# Altium schematic sheet FPC_15ICS_80LEDS_150MM.SchDoc
size A2
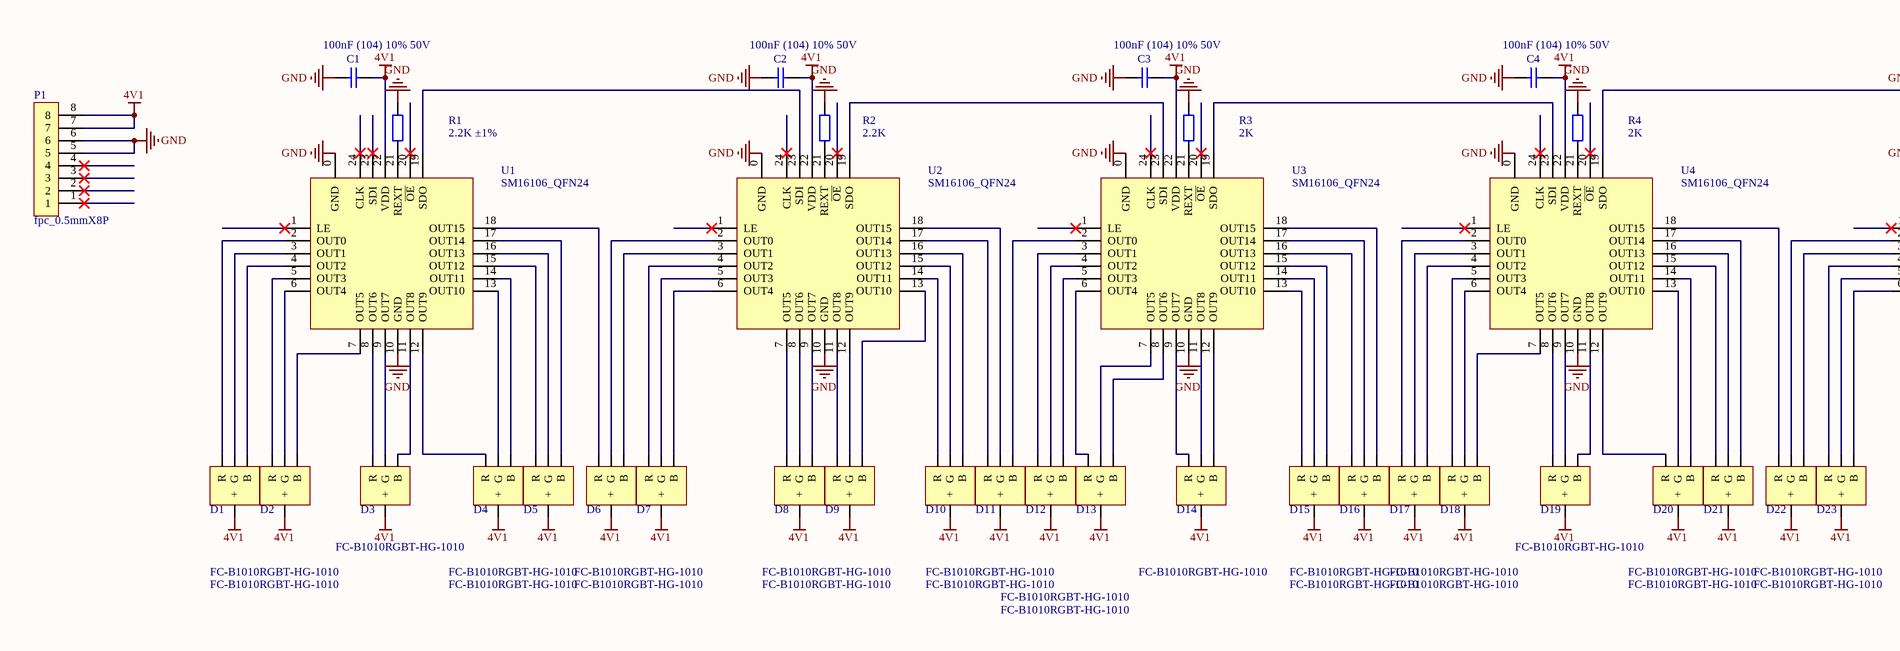
[diagram p0: FPC_15ICS_80LEDS_150MM.SchDoc, left]
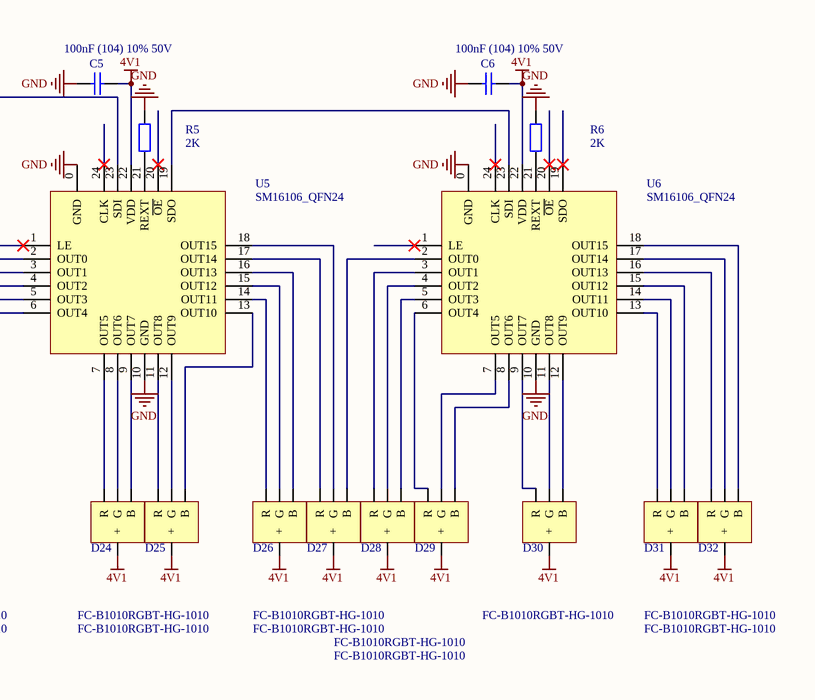
[diagram p1: FPC_15ICS_80LEDS_150MM.SchDoc, right]

## Parts
C1  100nF (104) 10% 50V  [0402_C]
C2  100nF (104) 10% 50V  [0402_C]
C3  100nF (104) 10% 50V  [0402_C]
C4  100nF (104) 10% 50V  [0402_C]
C5  100nF (104) 10% 50V  [0402_C]
C6  100nF (104) 10% 50V  [0402_C]
D1  FC-B1010RGBT-HG-1010  [LED-SMD-0.385X0.45X0.45]
D2  FC-B1010RGBT-HG-1010  [LED-SMD-0.385X0.45X0.45]
D3  FC-B1010RGBT-HG-1010  [LED-SMD-0.385X0.45X0.45]
D4  FC-B1010RGBT-HG-1010  [LED-SMD-0.385X0.45X0.45]
D5  FC-B1010RGBT-HG-1010  [LED-SMD-0.385X0.45X0.45]
D6  FC-B1010RGBT-HG-1010  [LED-SMD-0.385X0.45X0.45]
D7  FC-B1010RGBT-HG-1010  [LED-SMD-0.385X0.45X0.45]
D8  FC-B1010RGBT-HG-1010  [LED-SMD-0.385X0.45X0.45]
D9  FC-B1010RGBT-HG-1010  [LED-SMD-0.385X0.45X0.45]
D10  FC-B1010RGBT-HG-1010  [LED-SMD-0.385X0.45X0.45]
D11  FC-B1010RGBT-HG-1010  [LED-SMD-0.385X0.45X0.45]
D12  FC-B1010RGBT-HG-1010  [LED-SMD-0.385X0.45X0.45]
D13  FC-B1010RGBT-HG-1010  [LED-SMD-0.385X0.45X0.45]
D14  FC-B1010RGBT-HG-1010  [LED-SMD-0.385X0.45X0.45]
D15  FC-B1010RGBT-HG-1010  [LED-SMD-0.385X0.45X0.45]
D16  FC-B1010RGBT-HG-1010  [LED-SMD-0.385X0.45X0.45]
D17  FC-B1010RGBT-HG-1010  [LED-SMD-0.385X0.45X0.45]
D18  FC-B1010RGBT-HG-1010  [LED-SMD-0.385X0.45X0.45]
D19  FC-B1010RGBT-HG-1010  [LED-SMD-0.385X0.45X0.45]
D20  FC-B1010RGBT-HG-1010  [LED-SMD-0.385X0.45X0.45]
D21  FC-B1010RGBT-HG-1010  [LED-SMD-0.385X0.45X0.45]
D22  FC-B1010RGBT-HG-1010  [LED-SMD-0.385X0.45X0.45]
D23  FC-B1010RGBT-HG-1010  [LED-SMD-0.385X0.45X0.45]
D24  FC-B1010RGBT-HG-1010  [LED-SMD-0.385X0.45X0.45]
D25  FC-B1010RGBT-HG-1010  [LED-SMD-0.385X0.45X0.45]
D26  FC-B1010RGBT-HG-1010  [LED-SMD-0.385X0.45X0.45]
D27  FC-B1010RGBT-HG-1010  [LED-SMD-0.385X0.45X0.45]
D28  FC-B1010RGBT-HG-1010  [LED-SMD-0.385X0.45X0.45]
D29  FC-B1010RGBT-HG-1010  [LED-SMD-0.385X0.45X0.45]
D30  FC-B1010RGBT-HG-1010  [LED-SMD-0.385X0.45X0.45]
D31  FC-B1010RGBT-HG-1010  [LED-SMD-0.385X0.45X0.45]
D32  FC-B1010RGBT-HG-1010  [LED-SMD-0.385X0.45X0.45]
P1  fpc_0.5mmX8P  [goldfiger_fpc_8]
R1  2.2K ±1%  [0603_R]
R2  2.2K  [0603_R]
R3  2K  [0603_R]
R4  2K  [0603_R]
R5  2K  [0603_R]
R6  2K  [0603_R]
U1  SM16106_QFN24  [QFN-24_4x4x05tcp]
U2  SM16106_QFN24  [QFN-24_4x4x05tcp]
U3  SM16106_QFN24  [QFN-24_4x4x05tcp]
U4  SM16106_QFN24  [QFN-24_4x4x05tcp]
U5  SM16106_QFN24  [QFN-24_4x4x05tcp]
U6  SM16106_QFN24  [QFN-24_4x4x05tcp]

## Nets
4V1: C1.2 C2.2 C3.2 C4.2 C5.2 C6.2 D1.1(+) D2.1(+) D3.1(+) D4.1(+) D5.1(+) D6.1(+) D7.1(+) D8.1(+) D9.1(+) D10.1(+) D11.1(+) D12.1(+) D13.1(+) D14.1(+) D15.1(+) D16.1(+) D17.1(+) D18.1(+) D19.1(+) D20.1(+) D21.1(+) D22.1(+) D23.1(+) D24.1(+) D25.1(+) D26.1(+) D27.1(+) D28.1(+) D29.1(+) D30.1(+) D31.1(+) D32.1(+) P1.7 P1.8 U1.22(VDD) U2.22(VDD) U3.22(VDD) U4.22(VDD) U5.22(VDD) U6.22(VDD)
GND: C1.1 C2.1 C3.1 C4.1 C5.1 C6.1 P1.5 P1.6 R1.2 R2.2 R3.2 R4.2 R5.2 R6.2 U1.0(GND) U1.10(GND) U2.0(GND) U2.10(GND) U3.0(GND) U3.10(GND) U4.0(GND) U4.10(GND) U5.0(GND) U5.10(GND) U6.0(GND) U6.10(GND)
NetD1_2: D1.2(R) U1.2(OUT0)
NetD1_3: D1.3(G) U1.3(OUT1)
NetD1_4: D1.4(B) U1.4(OUT2)
NetD2_2: D2.2(R) U1.5(OUT3)
NetD2_3: D2.3(G) U1.6(OUT4)
NetD2_4: D2.4(B) U1.7(OUT5)
NetD3_2: D3.2(R) U1.8(OUT6)
NetD3_3: D3.3(G) U1.9(OUT7)
NetD3_4: D3.4(B) U1.11(OUT8)
NetD4_2: D4.2(R) U1.12(OUT9)
NetD4_3: D4.3(G) U1.13(OUT10)
NetD4_4: D4.4(B) U1.14(OUT11)
NetD5_2: D5.2(R) U1.15(OUT12)
NetD5_3: D5.3(G) U1.16(OUT13)
NetD5_4: D5.4(B) U1.17(OUT14)
NetD6_2: D6.2(R) U1.18(OUT15)
NetD6_3: D6.3(G) U2.2(OUT0)
NetD6_4: D6.4(B) U2.3(OUT1)
NetD7_2: D7.2(R) U2.4(OUT2)
NetD7_3: D7.3(G) U2.5(OUT3)
NetD7_4: D7.4(B) U2.6(OUT4)
NetD8_2: D8.2(R) U2.7(OUT5)
NetD8_3: D8.3(G) U2.8(OUT6)
NetD8_4: D8.4(B) U2.9(OUT7)
NetD9_2: D9.2(R) U2.11(OUT8)
NetD9_3: D9.3(G) U2.12(OUT9)
NetD9_4: D9.4(B) U2.13(OUT10)
NetD10_2: D10.2(R) U2.14(OUT11)
NetD10_3: D10.3(G) U2.15(OUT12)
NetD10_4: D10.4(B) U2.16(OUT13)
NetD11_2: D11.2(R) U2.17(OUT14)
NetD11_3: D11.3(G) U2.18(OUT15)
NetD11_4: D11.4(B) U3.2(OUT0)
NetD12_2: D12.2(R) U3.3(OUT1)
NetD12_3: D12.3(G) U3.4(OUT2)
NetD12_4: D12.4(B) U3.5(OUT3)
NetD13_2: D13.2(R) U3.6(OUT4)
NetD13_3: D13.3(G) U3.7(OUT5)
NetD13_4: D13.4(B) U3.8(OUT6)
NetD14_2: D14.2(R) U3.9(OUT7)
NetD14_3: D14.3(G) U3.11(OUT8)
NetD14_4: D14.4(B) U3.12(OUT9)
NetD15_2: D15.2(R) U3.13(OUT10)
NetD15_3: D15.3(G) U3.14(OUT11)
NetD15_4: D15.4(B) U3.15(OUT12)
NetD16_2: D16.2(R) U3.16(OUT13)
NetD16_3: D16.3(G) U3.17(OUT14)
NetD16_4: D16.4(B) U3.18(OUT15)
NetD17_2: D17.2(R) U4.2(OUT0)
NetD17_3: D17.3(G) U4.3(OUT1)
NetD17_4: D17.4(B) U4.4(OUT2)
NetD18_2: D18.2(R) U4.5(OUT3)
NetD18_3: D18.3(G) U4.6(OUT4)
NetD18_4: D18.4(B) U4.7(OUT5)
NetD19_2: D19.2(R) U4.8(OUT6)
NetD19_3: D19.3(G) U4.9(OUT7)
NetD19_4: D19.4(B) U4.11(OUT8)
NetD20_2: D20.2(R) U4.12(OUT9)
NetD20_3: D20.3(G) U4.13(OUT10)
NetD20_4: D20.4(B) U4.14(OUT11)
NetD21_2: D21.2(R) U4.15(OUT12)
NetD21_3: D21.3(G) U4.16(OUT13)
NetD21_4: D21.4(B) U4.17(OUT14)
NetD22_2: D22.2(R) U4.18(OUT15)
NetD22_3: D22.3(G) U5.2(OUT0)
NetD22_4: D22.4(B) U5.3(OUT1)
NetD23_2: D23.2(R) U5.4(OUT2)
NetD23_3: D23.3(G) U5.5(OUT3)
NetD23_4: D23.4(B) U5.6(OUT4)
NetD24_2: D24.2(R) U5.7(OUT5)
NetD24_3: D24.3(G) U5.8(OUT6)
NetD24_4: D24.4(B) U5.9(OUT7)
NetD25_2: D25.2(R) U5.11(OUT8)
NetD25_3: D25.3(G) U5.12(OUT9)
NetD25_4: D25.4(B) U5.13(OUT10)
NetD26_2: D26.2(R) U5.14(OUT11)
NetD26_3: D26.3(G) U5.15(OUT12)
NetD26_4: D26.4(B) U5.16(OUT13)
NetD27_2: D27.2(R) U5.17(OUT14)
NetD27_3: D27.3(G) U5.18(OUT15)
NetD27_4: D27.4(B) U6.2(OUT0)
NetD28_2: D28.2(R) U6.3(OUT1)
NetD28_3: D28.3(G) U6.4(OUT2)
NetD28_4: D28.4(B) U6.5(OUT3)
NetD29_2: D29.2(R) U6.6(OUT4)
NetD29_3: D29.3(G) U6.7(OUT5)
NetD29_4: D29.4(B) U6.8(OUT6)
NetD30_2: D30.2(R) U6.9(OUT7)
NetD30_3: D30.3(G) U6.11(OUT8)
NetD30_4: D30.4(B) U6.12(OUT9)
NetD31_2: D31.2(R) U6.13(OUT10)
NetD31_3: D31.3(G) U6.14(OUT11)
NetD31_4: D31.4(B) U6.15(OUT12)
NetD32_2: D32.2(R) U6.16(OUT13)
NetD32_3: D32.3(G) U6.17(OUT14)
NetD32_4: D32.4(B) U6.18(OUT15)
NetR1_1: R1.1 U1.21(REXT)
NetR2_1: R2.1 U2.21(REXT)
NetR3_1: R3.1 U3.21(REXT)
NetR4_1: R4.1 U4.21(REXT)
NetR5_1: R5.1 U5.21(REXT)
NetR6_1: R6.1 U6.21(REXT)
NetU1_19: U1.19(SDO) U2.23(SDI)
NetU2_19: U2.19(SDO) U3.23(SDI)
NetU3_19: U3.19(SDO) U4.23(SDI)
NetU4_19: U4.19(SDO) U5.23(SDI)
NetU5_19: U5.19(SDO) U6.23(SDI)

Not connected (* = marked no-connect by the designer): P1 1* 2* 3* 4*; U1 1(LE)* 20(~{OE})* 23(SDI)* 24(CLK)*; U2 1(LE)* 20(~{OE})* 24(CLK)*; U3 1(LE)* 20(~{OE})* 24(CLK)*; U4 1(LE)* 20(~{OE})* 24(CLK)*; U5 1(LE)* 20(~{OE})* 24(CLK)*; U6 1(LE)* 19(SDO)* 20(~{OE})* 24(CLK)*

## Library data of the parts
C1-C6 = 0603 100nF (104) 10% 50V: 贴片电容; ComponentLink1Description: 供应商链接; ComponentLink1URL: http://www.szlcsc.com/product/details_15331.html; Package: 0603; Supplier: LC; SuppliersPartNumber: C14663
D1-D32 = LED_RGB_1010
R1 R4 = 0603 6.2KΩ (6201) 1%: 贴片电阻; ComponentLink1Description: 供应商链接; ComponentLink1URL: http://www.szlcsc.com/product/details_4667.html; Package: 0603; Supplier: LC; SuppliersPartNumber: C4260
R2 R5 = 0603 4.7KΩ (4701) 1%: 贴片电阻; ComponentLink1Description: 供应商链接; ComponentLink1URL: http://www.szlcsc.com/product/details_23889.html; Package: 0603; Supplier: LC; SuppliersPartNumber: C23162
R3 R6 = 0603 3.6KΩ (3601) 1%: 贴片电阻; ComponentLink1Description: 供应商链接; ComponentLink1URL: http://www.szlcsc.com/product/details_23707.html; Package: 0603; Supplier: LC; SuppliersPartNumber: C22980